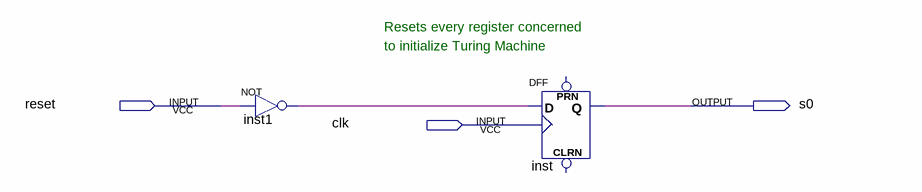
[diagram p0: schematic sheet]
// Quartus schematic s0.bdf as structural Verilog: 2 symbols, 3 pins
module s0 (
  input  reset,
  input  clk,
  output s0
);

  wire inst1_out;

  not inst1 (inst1_out, reset);
  DFF inst (.CLK(clk), .D(inst1_out), .Q(s0));  // open: CLRN, PRN

  // Notes on the sheet:
  //   Resets every register concerned
  //   to initialize Turing Machine
endmodule
